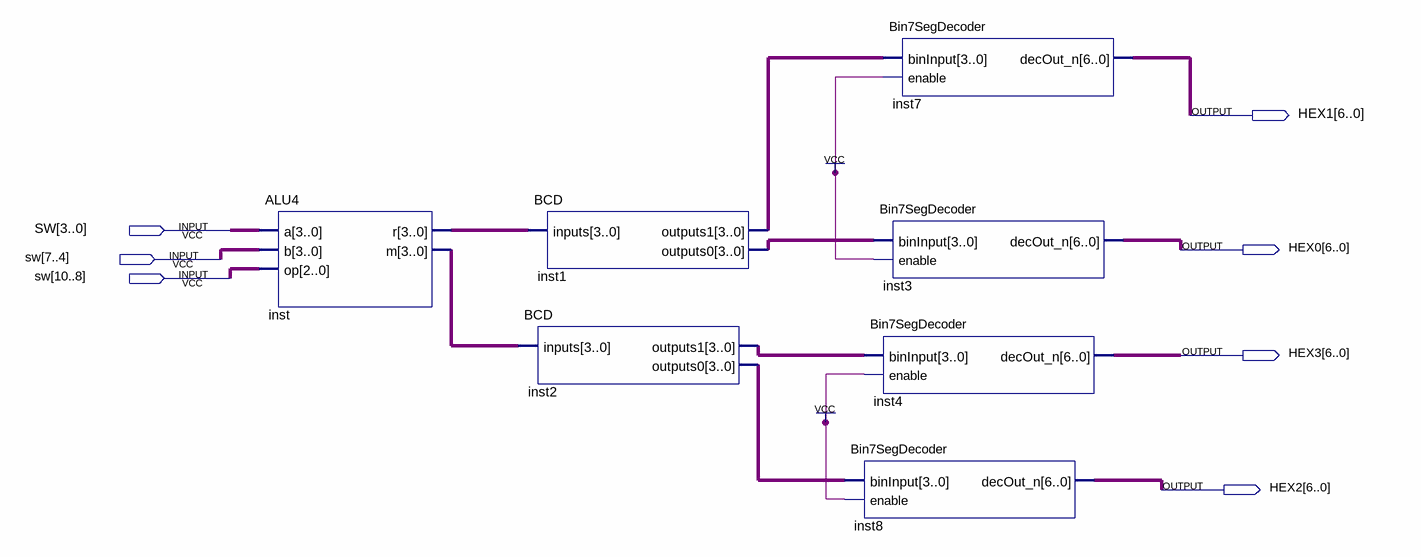
[diagram p0: schematic sheet]
// Quartus schematic ALUDemo.bdf as structural Verilog: 7 symbols, 7 pins
module ALUDemo (
  input  [10:0] SW,
  output [6:0] HEX1,
  output [6:0] HEX0,
  output [6:0] HEX3,
  output [6:0] HEX2
);

  wire [3:0] inst1_outputs0, inst1_outputs1, inst2_outputs0, inst2_outputs1, inst_m, inst_r;

  ALU4 inst (.a(SW[3:0]), .b(SW[7:4]), .op(SW[10:8]), .r(inst_r), .m(inst_m));
  BCD inst2 (.inputs(inst_m), .outputs1(inst2_outputs1), .outputs0(inst2_outputs0));
  BCD inst1 (.inputs(inst_r), .outputs1(inst1_outputs1), .outputs0(inst1_outputs0));
  Bin7SegDecoder inst7 (.binInput(inst1_outputs1), .enable(1'b1), .decOut_n(HEX1));
  Bin7SegDecoder inst3 (.binInput(inst1_outputs0), .enable(1'b1), .decOut_n(HEX0));
  Bin7SegDecoder inst4 (.binInput(inst2_outputs1), .enable(1'b1), .decOut_n(HEX3));
  Bin7SegDecoder inst8 (.binInput(inst2_outputs0), .enable(1'b1), .decOut_n(HEX2));
endmodule
